# Altium project RF Oscillator - R3.PrjPcb
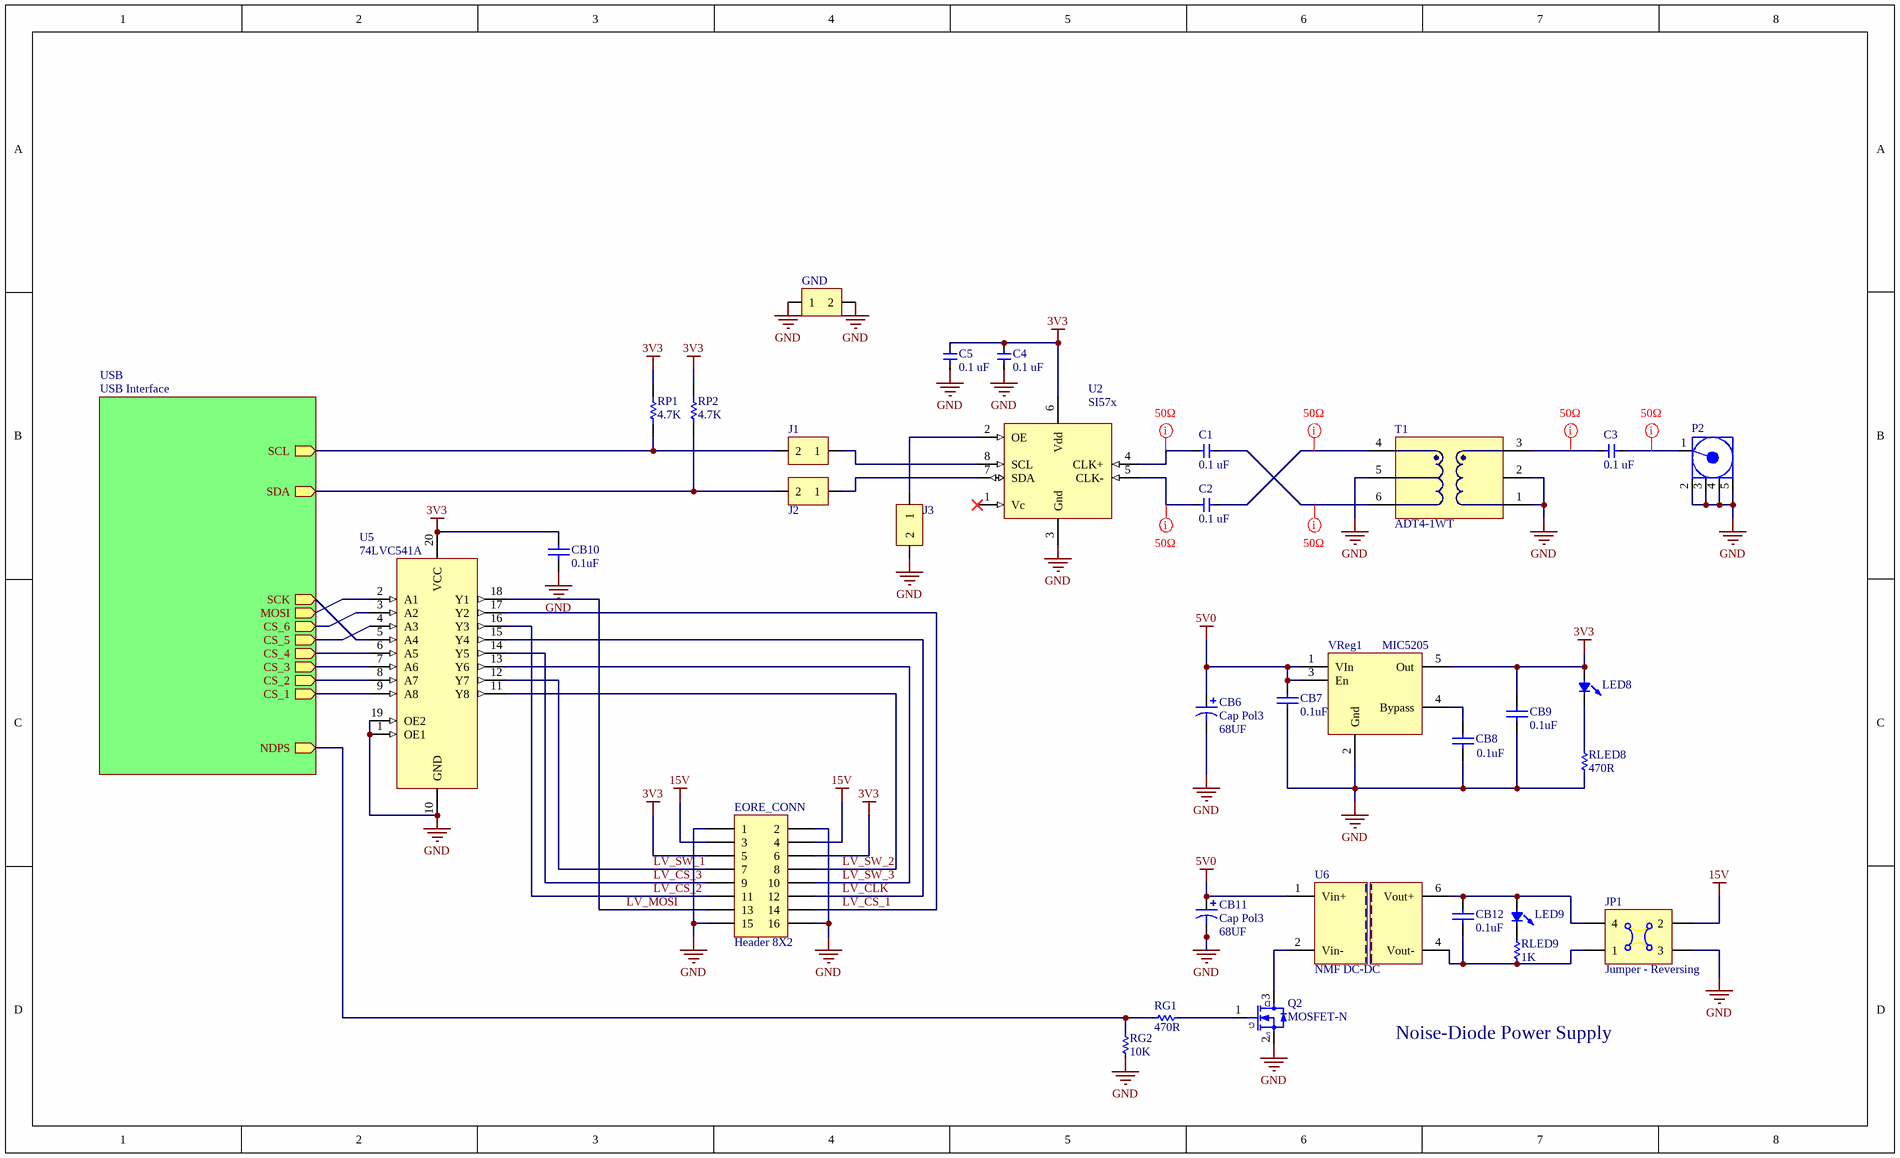
[diagram p0: Main.SchDoc]
2 sheets, 59 parts. Net scope: hierarchical (ports join the sheet entries above them; power ports are global).
Board file: Main.PcbDoc
Sheets:
  Main.SchDoc
    USB = USB Interface.SchDoc

## Sheet Main.SchDoc
size Legal

### Parts
C1  value 0.1 uF  [0603C]  (hidden comment: SMT Cap)
C2  value 0.1 uF  [0603C]  (hidden comment: SMT Cap)
C3  value 0.1 uF  [0603C]  (hidden comment: SMT Cap)
C4  value 0.1 uF  [0603C]  (hidden comment: SMT Cap)
C5  value 0.1 uF  [0603C]  (hidden comment: SMT Cap)
CB6  Cap Pol3  value 68UF  [V]
CB7  value 0.1uF  [0603C]  (hidden comment: Cap Semi)
CB8  value 0.1uF  [0603C]  (hidden comment: Cap Semi)
CB9  value 0.1uF  [0603C]  (hidden comment: Cap Semi)
CB10  value 0.1uF  [0603C]  (hidden comment: Cap Semi)
CB11  Cap Pol3  value 68UF  [V]
CB12  value 0.1uF  [0603C]  (hidden comment: Cap Semi)
EORE_CONN  Header 8X2  [SMT 16-pin rectangular header]
GND  Jumper  [HDR1X2]  (value not drawn)
J1  Jumper  [HDR1X2]  (value not drawn)
J2  Jumper  [HDR1X2]  (value not drawn)
J3  Jumper  [HDR1X2]  (value not drawn)
JP1  Jumper - Reversing  [HDR2X2]
LED8  LED0  [T1 LED]  (value not drawn)
LED9  LED0  [T1 LED]  (value not drawn)
P2  COAX-M  [SMA Jack - PCB Edge - MultiSize]  (value not drawn)
Q2  MOSFET-N  [SOT23-3N]
RG1  value 470R  [0603R]  (hidden comment: Res Semi Small)
RG2  value 10K  [0603R]  (hidden comment: Res Semi Small)
RLED8  value 470R  [0603R]  (hidden comment: Res Semi Small)
RLED9  value 1K  [0603R]  (hidden comment: Res Semi Small)
RP1  value 4.7K  [0603R]  (hidden comment: Res Semi)
RP2  value 4.7K  [0603R]  (hidden comment: Res Semi)
T1  ADT4-1WT  [CD542]
U2  SI57x  [SI57x]
U5  74LVC541A  [SOP65P780-20AN]
U6  NMF DC-DC  [SIL-6(A1)]
VReg1  MIC5205  [SOT23-5AN]

### Sub-sheets
USB = USB Interface: SCL (out), SDA (out), SCK (out), MOSI (out), CS_1 (out), CS_2 (out), CS_3 (out), CS_4 (out), CS_5 (out), CS_6 (out), NDPS (out)

### Nets
3V3: C4.2 C5.2 CB9.2 CB10.2 EORE_CONN.5 EORE_CONN.6 LED8.1 RP1.2 RP2.2 U2.6(Vdd) U5.20(VCC) VReg1.5(Out)
5V0: CB6.1 CB7.2 CB11.1 U6.1(Vin+) VReg1.1(VIn) VReg1.3(En)
15V: EORE_CONN.3 EORE_CONN.4 JP1.2
GND: C4.1 C5.1 CB6.2 CB7.1 CB8.1 CB9.1 CB10.1 CB11.2 EORE_CONN.1 EORE_CONN.2 EORE_CONN.15 EORE_CONN.16 GND.1 GND.2 J3.2 JP1.3 P2.2(GND) P2.3(GND) P2.4(GND) P2.5(GND) Q2.2(S) RG2.1 RLED8.2 T1.1(Input) T1.2(Gnd) T1.5(Termination) U2.3(Gnd) U5.1(OE1) U5.10(GND) U5.19(OE2) VReg1.2(Gnd)
CS_1: U5.9(A8) ; sheet USB/CS_1
CS_2: U5.8(A7) ; sheet USB/CS_2
CS_3: U5.7(A6) ; sheet USB/CS_3
CS_4: U5.6(A5) ; sheet USB/CS_4
CS_5: U5.4(A3) ; sheet USB/CS_5
CS_6: U5.3(A2) ; sheet USB/CS_6
LV_CLK: EORE_CONN.12 U5.15(Y4)
LV_CS_1: EORE_CONN.14 U5.17(Y2)
LV_CS_2: EORE_CONN.11 U5.16(Y3)
LV_CS_3: EORE_CONN.9 U5.14(Y5)
LV_MOSI: EORE_CONN.13 U5.18(Y1)
LV_SW_1: EORE_CONN.7 U5.12(Y7)
LV_SW_2: EORE_CONN.8 U5.11(Y8)
LV_SW_3: EORE_CONN.10 U5.13(Y6)
NDPS: RG1.1 RG2.2 ; sheet USB/NDPS
PB3 (MOSI): U5.2(A1) ; sheet USB/MOSI
PB5 (SCK): U5.5(A4) ; sheet USB/SCK
SCL: J1.2 RP1.1 ; sheet USB/SCL
SDA: J2.2 RP2.1 ; sheet USB/SDA
NetC1_1: C1.1 U2.4(CLK+)
NetC1_2: C1.2 T1.6(Output)
NetC2_1: C2.1 U2.5(CLK-)
NetC2_2: C2.2 T1.4(Termination)
NetC3_1: C3.1 T1.3(Coupled)
NetC3_2: C3.2 P2.1(Signal)
NetCB8_2: CB8.2 VReg1.4(Bypass)
NetCB12_1: CB12.1 JP1.1 RLED9.2 U6.4(Vout-)
NetCB12_2: CB12.2 JP1.4 LED9.1 U6.6(Vout+)
NetJ1_1: J1.1 U2.8(SCL)
NetJ2_1: J2.1 U2.7(SDA)
NetJ3_1: J3.1 U2.2(OE)
NetLED8_2: LED8.2 RLED8.1
NetLED9_2: LED9.2 RLED9.1
NetQ2_1: Q2.1(G) RG1.2
NetQ2_3: Q2.3(D) U6.2(Vin-)

Not connected (* = marked no-connect by the designer): U2 1(Vc)*

### Layout directives
rule Width Constraint [Pref Impedance = 50.00ohms    Min Impedance = 45.00ohms    Max Impedance = 70.00ohms]: NetC1_1, NetC1_2, NetC2_1, NetC2_2, NetC3_1, NetC3_2

### Notes on the sheet
- Noise-Diode Power Supply

### Library data of the parts
C1-C5 = Cap - SMT Small: Published: 8-Jun-2000; LatestRevisionDate: 29-May-2009; LatestRevisionNote: IPC-7351 Footprint Added.; PackageReference: C1206; Publisher: Altium Limited; PackageDescription: Chip Capacitor
CB6 CB11 = Cap Pol3: KEMET T520 KO-CAP  Polymer SMT Tantalum; DKPN: 399-3330-1-ND; Voltage: 10V; Type: KEMET T520 KO-CAP  Polymer SMT Tantalum
CB7-CB10 CB12 = Cap Semi: Capacitor (Semiconductor SIM Model); Published: 8-Jun-2000; LatestRevisionDate: 17-Jul-2002; LatestRevisionNote: Re-released for DXP Platform.; PackageReference: C1206; Publisher: Altium Limited
EORE_CONN = Header 8X2: Header, 8-Pin, Dual row; LatestRevisionDate: 17-Jul-2002; LatestRevisionNote: Re-released for DXP Platform.; Publisher: Altium Limited
GND J1-J3 = Jumper - 2 Pin: Jumper - 2-Pin; LatestRevisionDate: 17-Jul-2002; LatestRevisionNote: Re-released for DXP Platform.; Publisher: Altium Limited
JP1 = Jumper - Reversing: Reversing Jumper; LatestRevisionDate: 17-Jul-2002; LatestRevisionNote: Re-released for DXP Platform.; Publisher: Altium Limited
LED8 LED9 = LED0: T 1 3/4 LED; Published: 8-Jun-2000; LatestRevisionDate: 08-Jul-2005; LatestRevisionNote: Mech Layer 1 removed.; PackageReference: LED-0; Publisher: Altium Limited
P2 = COAX-M: RF Coaxial PCB Connector, MMCX; Thru-Hole, Vertical Mount Plug,  50 Ohm Impedance; PackageDocument: Rev. A, 16-Jun-1997; PCB_Layout: Complies with manufacturer's recommendation.; DrillSize: Corresponds to nominal value.; Published: 15-Jul-2004; LatestRevisionDate: 15-Jul-2004; LatestRevisionNote: Component Replaced.; DatasheetDocument: 30-May-2003; PackageReference: 908-21103; Publisher: Altium Limited; ComponentLink1Description: Manufacturer Link; ComponentLink1URL: http://www.amphenolrf.com/
Q2 = MOSFET-N: N-Channel MOSFET; Published: 8-Jun-2000; LatestRevisionDate: 17-Jul-2002; LatestRevisionNote: Re-released for DXP Platform.; PackageVersion: 1995/1996; PackageReference: E3; Publisher: Altium Limited
RG1 RG2 RLED8 RLED9 = Res Semi Small: Semiconductor Resistor; Published: 8-Jun-2000; LatestRevisionDate: 17-Jul-2002; LatestRevisionNote: Re-released for DXP Platform.; PackageReference: AXIAL-0.5; Publisher: Altium Limited
RP1 RP2 = Res Semi: Semiconductor Resistor; Published: 8-Jun-2000; LatestRevisionDate: 17-Jul-2002; LatestRevisionNote: Re-released for DXP Platform.; PackageReference: AXIAL-0.5; Publisher: Altium Limited
T1 = ADT4-1WT: Surface Mount RF Transformer
U2 = SI570: 10 MHZ TO 1.4 GHZ I2C PROGRAMMABLE XO/VCXO
U5 = 74LVC541A: Octal buffer/line driver with 5 V tolerant inputs/outputs; 3-state
U6 = Murata NMF DC-DC: Murata NMF DC-DC - 1W, Single output
VReg1 = MIC5205: 150mA Low-Noise LDO Regulator

## Sheet USB Interface.SchDoc
size Tabloid
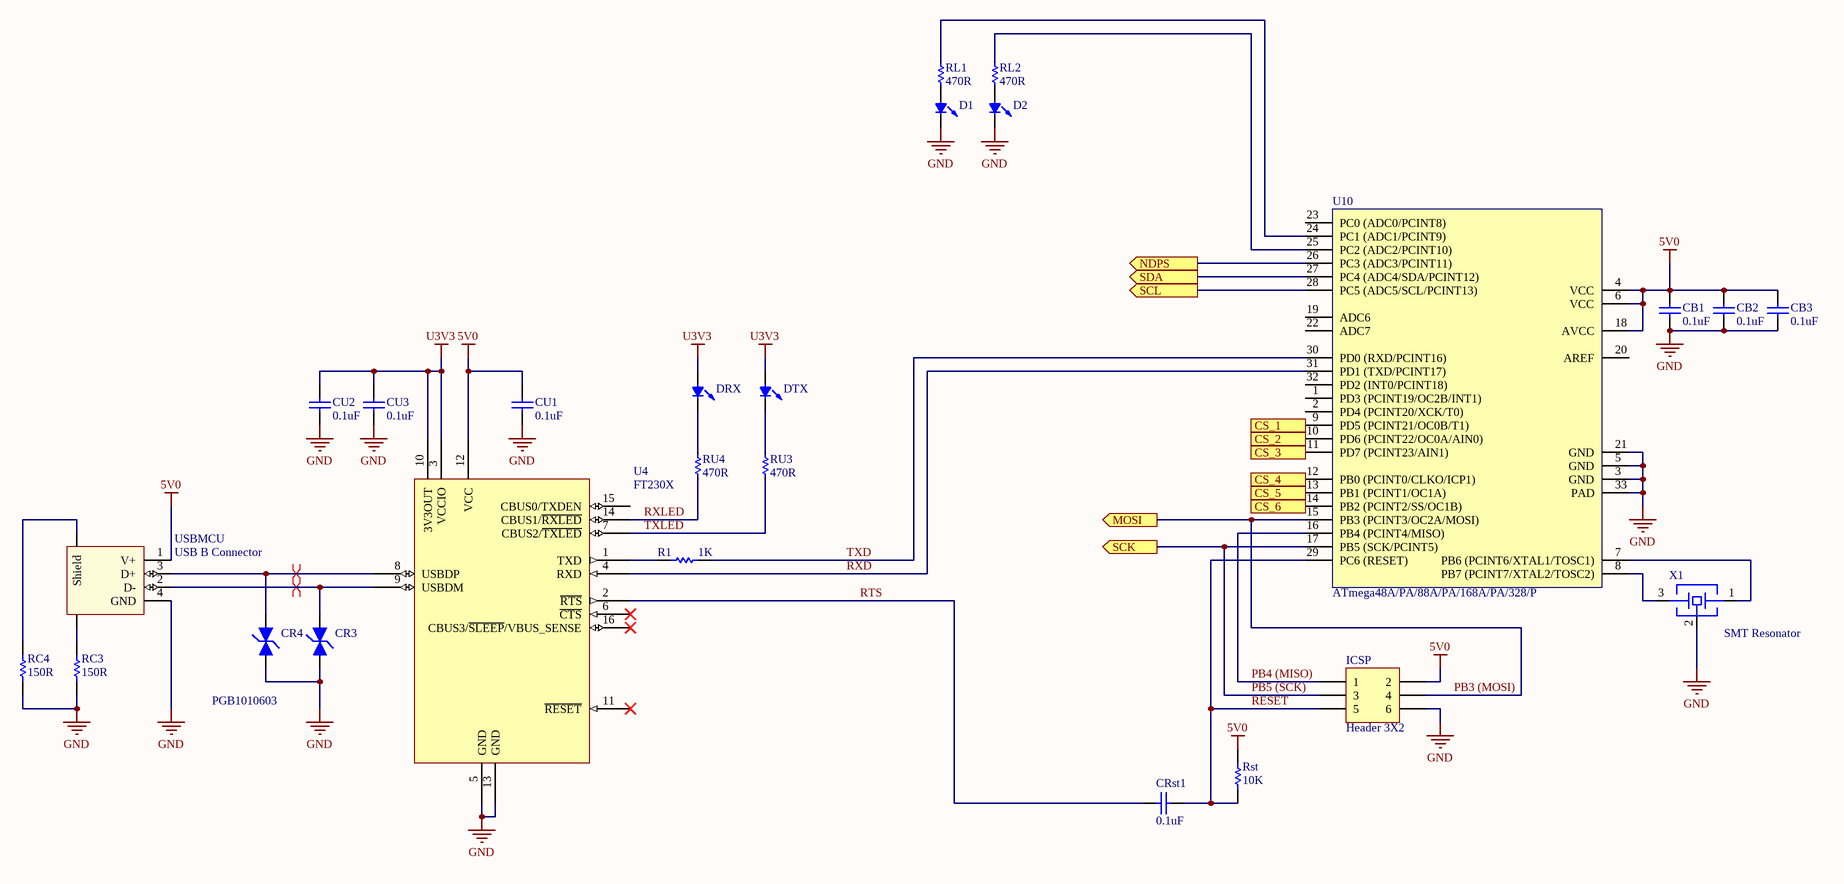
[diagram p1: USB Interface.SchDoc]

### Parts
CB1  value 0.1uF  [0603C]  (hidden comment: Cap Semi)
CB2  value 0.1uF  [0603C]  (hidden comment: Cap Semi)
CB3  value 0.1uF  [0603C]  (hidden comment: Cap Semi)
CR3  PGB1010603  [0603PG]  (value not drawn)
CR4  PGB1010603  [0603PG]
CRst1  value 0.1uF  [0603C]  (hidden comment: Cap Semi)
CU1  value 0.1uF  [0603C]  (hidden comment: Cap Semi)
CU2  value 0.1uF  [0603C]  (hidden comment: Cap Semi)
CU3  value 0.1uF  [0603C]  (hidden comment: Cap Semi)
D1  LED0  [T1 LED]  (value not drawn)
D2  LED0  [T1 LED]  (value not drawn)
DRX  LED0  [T1 LED]  (value not drawn)
DTX  LED0  [T1 LED]  (value not drawn)
ICSP  Header 3X2  [HDR2X3]
R1  value 1K  [0603R]  (hidden comment: Res Semi)
RC3  value 150R  [1206R]  (hidden comment: Res Semi)
RC4  value 150R  [1206R]  (hidden comment: Res Semi)
RL1  value 470R  [0603R]  (hidden comment: Res Semi Small)
RL2  value 470R  [0603R]  (hidden comment: Res Semi Small)
Rst  value 10K  [0603R]  (hidden comment: Res Semi)
RU3  value 470R  [0603R]  (hidden comment: Res Semi Small)
RU4  value 470R  [0603R]  (hidden comment: Res Semi Small)
U4  FT230X  [SOP635P600-16AN]
U10  ATmega48A/PA/88A/PA/168A/PA/328/P  [TQFP80P900X900X120-32N]
USBMCU  USB B Connector  [USB Connector (type B)]
X1  SMT Resonator  [CSTCE_V]

### Ports
CS_1 (out), CS_2 (out), CS_3 (out), CS_4 (out), CS_5 (out), CS_6 (out), MOSI (out), NDPS (out), SCK (out), SCL (out), SDA (out)

### Nets
5V0: CB1.2 CB2.2 CB3.2 CU1.2 ICSP.2 Rst.2 U4.12(VCC) U10.4(VCC) U10.6(VCC) U10.18(AVCC) USBMCU.1(V+)
GND: CB1.1 CB2.1 CB3.1 CR3.2 CR4.2 CU1.1 CU2.1 CU3.1 D1.2 D2.2 ICSP.6 RC3.1 RC4.1 U4.5(GND) U4.13(GND) U10.3(GND) U10.5(GND) U10.21(GND) U10.33(PAD) USBMCU.4(GND) X1.2
U3V3: CU2.2 CU3.2 DRX.1 DTX.1 U4.3(VCCIO) U4.10(3V3OUT)
~{RESET}: CRst1.2 ICSP.5 Rst.1 U10.29(PC6_(RESET))
CS_1: U10.9(PD5_(PCINT21/OC0B/T1)) ; port CS_1
CS_2: U10.10(PD6_(PCINT22/OC0A/AIN0)) ; port CS_2
CS_3: U10.11(PD7_(PCINT23/AIN1)) ; port CS_3
CS_4: U10.12(PB0_(PCINT0/CLKO/ICP1)) ; port CS_4
CS_5: U10.13(PB1_(PCINT1/OC1A)) ; port CS_5
CS_6: U10.14(PB2_(PCINT2/SS/OC1B)) ; port CS_6
NDPS: U10.26(PC3_(ADC3/PCINT11)) ; port NDPS
PB3 (MOSI): ICSP.4 U10.15(PB3_(PCINT3/OC2A/MOSI)) ; port MOSI
PB4 (MISO): ICSP.1 U10.16(PB4_(PCINT4/MISO))
PB5 (SCK): ICSP.3 U10.17(PB5_(SCK/PCINT5)) ; port SCK
RTS: CRst1.1 U4.2(~{RTS})
RXD: U4.4(RXD) U10.31(PD1_(TXD/PCINT17))
RXLED: RU4.2 U4.14(CBUS1/~{RXLED})
SCL: U10.28(PC5_(ADC5/SCL/PCINT13)) ; port SCL
SDA: U10.27(PC4_(ADC4/SDA/PCINT12)) ; port SDA
TXD: R1.2 U10.30(PD0_(RXD/PCINT16))
TXLED: RU3.2 U4.7(CBUS2/~{TXLED})
NetCR3_1: CR3.1 U4.9(USBDM) USBMCU.2(D-)
NetCR4_1: CR4.1 U4.8(NC) USBMCU.3(D+)
NetD1_1: D1.1 RL1.2
NetD2_1: D2.1 RL2.2
NetDRX_2: DRX.2 RU4.1
NetDTX_2: DTX.2 RU3.1
NetR1_1: R1.1 U4.1(TXD)
NetRC3_2: RC3.2 USBMCU.5(Gnd)
NetRC4_2: RC4.2 USBMCU.6(Shield)
NetRL1_1: RL1.1 U10.24(PC1_(ADC1/PCINT9))
NetRL2_1: RL2.1 U10.25(PC2_(ADC2/PCINT10))
NetU10_7: U10.7(PB6_(PCINT6/XTAL1/TOSC1)) X1.1
NetU10_8: U10.8(PB7_(PCINT7/XTAL2/TOSC2)) X1.3

Not connected (* = marked no-connect by the designer): U4 6(~{CTS})* 11(~{RESET})* 15(CBUS0/TXDEN) 16(CBUS3/~{SLEEP}/VBUS_SENSE)* 24(NC); U10 1(PD3_(PCINT19/OC2B/INT1)) 2(PD4_(PCINT20/XCK/T0)) 19(ADC6) 20(AREF) 22(ADC7) 23(PC0_(ADC0/PCINT8)) 32(PD2_(INT0/PCINT18))

### Layout directives
differential pair: NetCR3_1, NetCR4_1

### Library data of the parts
CB1-CB3 CRst1 CU1-CU3 = Cap Semi: Capacitor (Semiconductor SIM Model); Published: 8-Jun-2000; LatestRevisionDate: 17-Jul-2002; LatestRevisionNote: Re-released for DXP Platform.; PackageReference: C1206; Publisher: Altium Limited
CR3 CR4 = PGB1010603: PulseGuard® Lead-Free 0603 Surface Mount Polymeric ESD Suppressors
D1 D2 DRX DTX = LED0: T 1 3/4 LED; Published: 8-Jun-2000; LatestRevisionDate: 08-Jul-2005; LatestRevisionNote: Mech Layer 1 removed.; PackageReference: LED-0; Publisher: Altium Limited
ICSP = Header 3X2: Header, 3-Pin, Dual row; LatestRevisionDate: 17-Jul-2002; LatestRevisionNote: Re-released for DXP Platform.; Publisher: Altium Limited
R1 RC3 RC4 Rst = Res Semi: Semiconductor Resistor; Published: 8-Jun-2000; LatestRevisionDate: 17-Jul-2002; LatestRevisionNote: Re-released for DXP Platform.; PackageReference: AXIAL-0.5; Publisher: Altium Limited
RL1 RL2 RU3 RU4 = Res Semi Small: Semiconductor Resistor; Published: 8-Jun-2000; LatestRevisionDate: 17-Jul-2002; LatestRevisionNote: Re-released for DXP Platform.; PackageReference: AXIAL-0.5; Publisher: Altium Limited
U4 = FT230X: USB To Basic Serial Bridge IC; DKPN: 768-1135-1-ND; Datasheet: http://www.ftdichip.com/Support/Documents/DataSheets/ICs/DS_FT230X.pdf
U10 = ATmega48A/PA/88A/PA/168A/PA/328/P: Atmel 8-bit Microcontroller with 4/8/16/32KBytes In-  System Programmable Flash
USBMCU = USB B connector - Through hole
X1 = SMT Resonator: 16 MHz SMT Resonator; DKPN: 490-1198-1-ND; MFGPN: CSTCE16M0V53-R0; DKDESC: CER RESONATOR 16.0MHZ SMD

## Nets that join several sheets
5V0: Main (6 pins), USB Interface (11 pins)
GND: Main (31 pins), USB Interface (21 pins)
CS_1: Main (U5.9), USB Interface (U10.9)
CS_2: Main (U5.8), USB Interface (U10.10)
CS_3: Main (U5.7), USB Interface (U10.11)
CS_4: Main (U5.6), USB Interface (U10.12)
CS_5: Main (U5.4), USB Interface (U10.13)
CS_6: Main (U5.3), USB Interface (U10.14)
NDPS: Main (RG1.1 RG2.2), USB Interface (U10.26)
PB3 (MOSI): Main (U5.2), USB Interface (ICSP.4 U10.15)
PB5 (SCK): Main (U5.5), USB Interface (ICSP.3 U10.17)
SCL: Main (J1.2 RP1.1), USB Interface (U10.28)
SDA: Main (J2.2 RP2.1), USB Interface (U10.27)